# Altium schematic sheet BSPDSpring24.SchDoc
size Tabloid; DrawnBy: Ethan Zifzal; Revision: AE; SheetNumber: 1; SheetTotal: 1; Application_BuildNumber: ddd
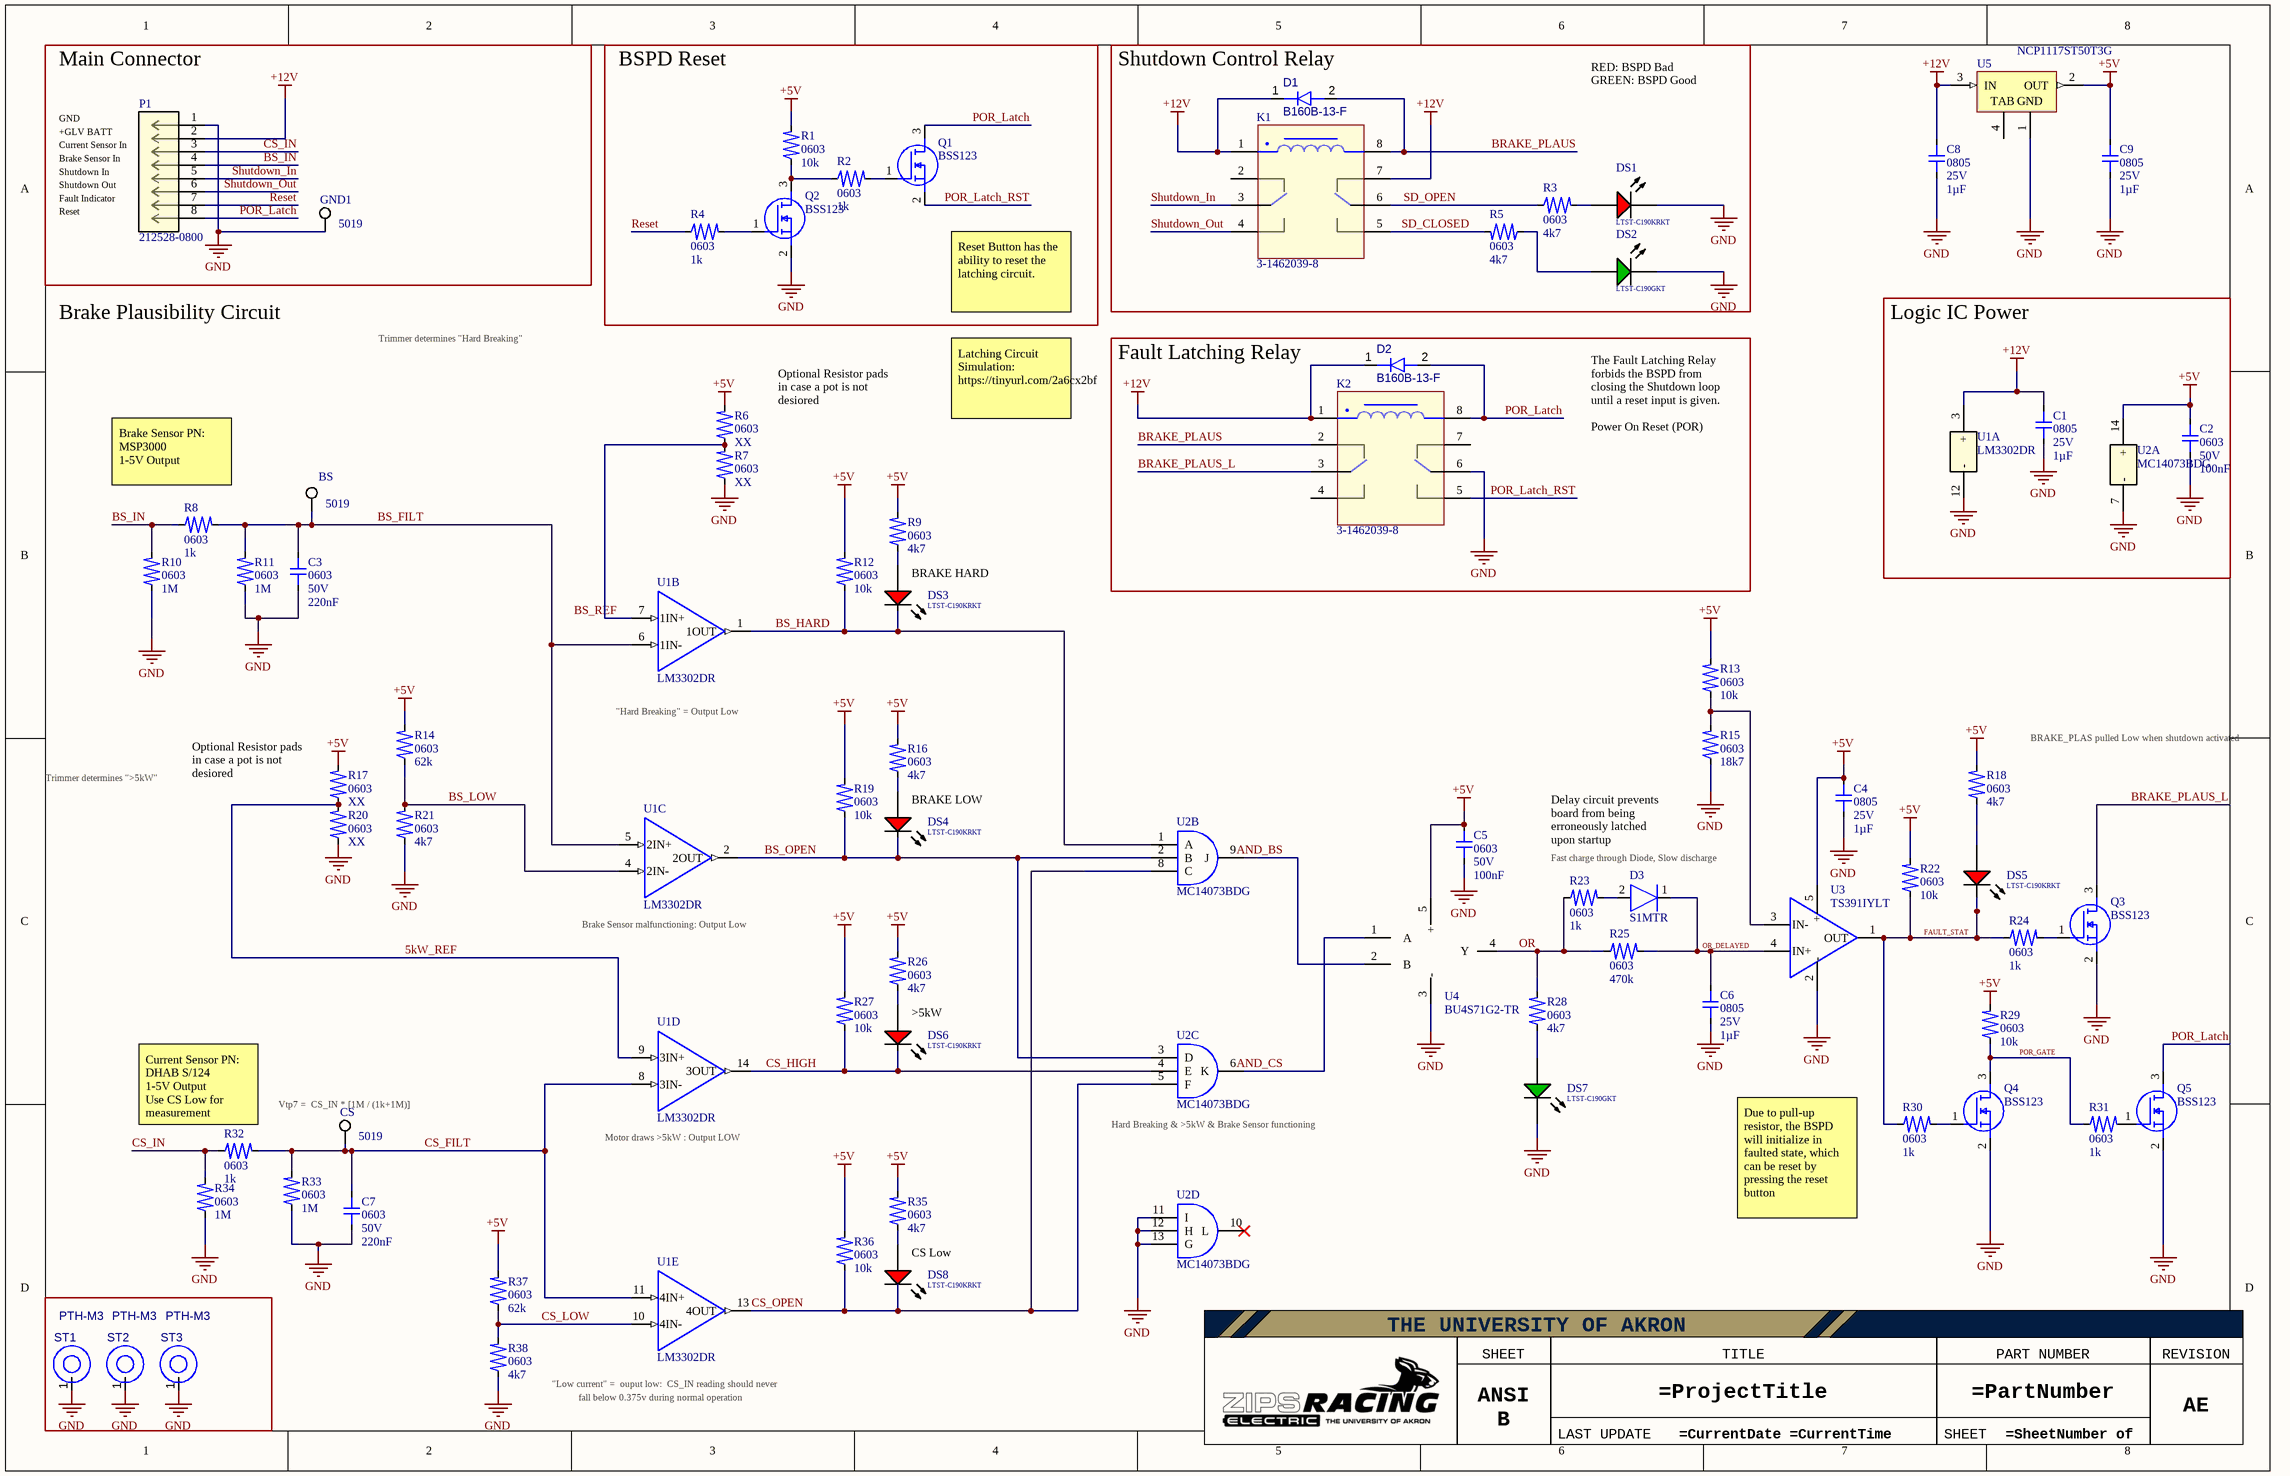
[diagram p0: BSPDSpring24.SchDoc]

## Parts
BS  5019  [KSTN-5019_V]
C1  value 1µF  Footprint: 0805  Voltage: 25V  [CAP-0805]  (hidden comment: Capacitor 1uF 0805 25V)
C2  value 100nF  Footprint: 0603  Voltage: 50V  [CAP-0603-Generic]  (hidden comment: Capacitor 100nF 0603 5%)
C3  value 220nF  Footprint: 0603  Voltage: 50V  [CAP-0603-Generic]  (hidden comment: Capacitor 220nF 0603 5%)
C4  value 1µF  Footprint: 0805  Voltage: 25V  [CAP-0805]  (hidden comment: Capacitor 1uF 0805 25V)
C5  value 100nF  Footprint: 0603  Voltage: 50V  [CAP-0603-Generic]  (hidden comment: Capacitor 100nF 0603 5%)
C6  value 1µF  Footprint: 0805  Voltage: 25V  [CAP-0805]  (hidden comment: Capacitor 1uF 0805 25V)
C7  value 220nF  Footprint: 0603  Voltage: 50V  [CAP-0603-Generic]  (hidden comment: Capacitor 220nF 0603 5%)
C8  value 1µF  Footprint: 0805  Voltage: 25V  [CAP-0805]  (hidden comment: Capacitor 1uF 0805 25V)
C9  value 1µF  Footprint: 0805  Voltage: 25V  [CAP-0805]  (hidden comment: Capacitor 1uF 0805 25V)
CS  5019  [KSTN-5019_V]
D1  B160B-13-F  [FP-SMB-MFG]
D2  B160B-13-F  [FP-SMB-MFG]
D3  S1MTR  [SMA_SDS]
DS1  LTST-C190KRKT  [LTST-C191KRKT_V]
DS2  LTST-C190GKT  [LTST-C190GKT_V]
DS3  LTST-C190KRKT  [LTST-C191KRKT_V]
DS4  LTST-C190KRKT  [LTST-C191KRKT_V]
DS5  LTST-C190KRKT  [LTST-C191KRKT_V]
DS6  LTST-C190KRKT  [LTST-C191KRKT_V]
DS7  LTST-C190GKT  [LTST-C190GKT_V]
DS8  LTST-C190KRKT  [LTST-C191KRKT_V]
GND1  5019  [KSTN-5019_V]
K1  3-1462039-8  [FP-3-1462039-8-MFG]
K2  3-1462039-8  [FP-3-1462039-8-MFG]
P1  212528-0800  [212528-0800-Footprint-1]
Q1  BSS123  [SOT96P237X111-3N]
Q2  BSS123  [SOT96P237X111-3N]
Q3  BSS123  [SOT96P237X111-3N]
Q4  BSS123  [SOT96P237X111-3N]
Q5  BSS123  [SOT96P237X111-3N]
R1  value 10k  Footprint: 0603  [RES-0603-Generic]  (hidden comment: Resistor 10k 0603 1%)
R2  value 1k  Footprint: 0603  [RES-0603-Generic]  (hidden comment: Resistor 1k 0603 1%)
R3  value 4k7  Footprint: 0603  [RES-0603-Generic]  (hidden comment: Resistor 4k7 0603 1%)
R4  value 1k  Footprint: 0603  [RES-0603-Generic]  (hidden comment: Resistor 1k 0603 1%)
R5  value 4k7  Footprint: 0603  [RES-0603-Generic]  (hidden comment: Resistor 4k7 0603 1%)
R6  value XX  Footprint: 0603  [RES-0603-Generic]  (hidden comment: Resistor XX 0603 1%)
R7  value XX  Footprint: 0603  [RES-0603-Generic]  (hidden comment: Resistor XX 0603 1%)
R8  value 1k  Footprint: 0603  [RES-0603-Generic]  (hidden comment: Resistor 1k 0603 1%)
R9  value 4k7  Footprint: 0603  [RES-0603-Generic]  (hidden comment: Resistor 4k7 0603 1%)
R10  value 1M  Footprint: 0603  [RES-0603-Generic]  (hidden comment: Resistor 1M 0603 1%)
R11  value 1M  Footprint: 0603  [RES-0603-Generic]  (hidden comment: Resistor 1M 0603 1%)
R12  value 10k  Footprint: 0603  [RES-0603-Generic]  (hidden comment: Resistor 10k 0603 1%)
R13  value 10k  Footprint: 0603  [RES-0603-Generic]  (hidden comment: Resistor 10k 0603 1%)
R14  value 62k  Footprint: 0603  [RES-0603-Generic]  (hidden comment: Resistor 62k 0603 1%)
R15  value 18k7  Footprint: 0603  [RES-0603-Generic]  (hidden comment: Resistor 10k 0603 1%)
R16  value 4k7  Footprint: 0603  [RES-0603-Generic]  (hidden comment: Resistor 4k7 0603 1%)
R17  value XX  Footprint: 0603  [RES-0603-Generic]  (hidden comment: Resistor XX 0603 1%)
R18  value 4k7  Footprint: 0603  [RES-0603-Generic]  (hidden comment: Resistor 4k7 0603 1%)
R19  value 10k  Footprint: 0603  [RES-0603-Generic]  (hidden comment: Resistor 10k 0603 1%)
R20  value XX  Footprint: 0603  [RES-0603-Generic]  (hidden comment: Resistor XX 0603 1%)
R21  value 4k7  Footprint: 0603  [RES-0603-Generic]  (hidden comment: Resistor 4k7 0603 1%)
R22  value 10k  Footprint: 0603  [RES-0603-Generic]  (hidden comment: Resistor 10k 0603 1%)
R23  value 1k  Footprint: 0603  [RES-0603-Generic]  (hidden comment: Resistor 1k 0603 1%)
R24  value 1k  Footprint: 0603  [RES-0603-Generic]  (hidden comment: Resistor 1k 0603 1%)
R25  value 470k  Footprint: 0603  [RES-0603-Generic]  (hidden comment: Resistor 470k 0603 1%)
R26  value 4k7  Footprint: 0603  [RES-0603-Generic]  (hidden comment: Resistor 4k7 0603 1%)
R27  value 10k  Footprint: 0603  [RES-0603-Generic]  (hidden comment: Resistor 10k 0603 1%)
R28  value 4k7  Footprint: 0603  [RES-0603-Generic]  (hidden comment: Resistor 4k7 0603 1%)
R29  value 10k  Footprint: 0603  [RES-0603-Generic]  (hidden comment: Resistor 10k 0603 1%)
R30  value 1k  Footprint: 0603  [RES-0603-Generic]  (hidden comment: Resistor 1k 0603 1%)
R31  value 1k  Footprint: 0603  [RES-0603-Generic]  (hidden comment: Resistor 1k 0603 1%)
R32  value 1k  Footprint: 0603  [RES-0603-Generic]  (hidden comment: Resistor 1k 0603 1%)
R33  value 1M  Footprint: 0603  [RES-0603-Generic]  (hidden comment: Resistor 1M 0603 1%)
R34  value 1M  Footprint: 0603  [RES-0603-Generic]  (hidden comment: Resistor 1M 0603 1%)
R35  value 4k7  Footprint: 0603  [RES-0603-Generic]  (hidden comment: Resistor 4k7 0603 1%)
R36  value 10k  Footprint: 0603  [RES-0603-Generic]  (hidden comment: Resistor 10k 0603 1%)
R37  value 62k  Footprint: 0603  [RES-0603-Generic]  (hidden comment: Resistor 62k 0603 1%)
R38  value 4k7  Footprint: 0603  [RES-0603-Generic]  (hidden comment: Resistor 4k7 0603 1%)
ST1  PTH-M3  [PTH-M2D5X5]  (no BOM)
ST2  PTH-M3  [PTH-M2D5X5]  (no BOM)
ST3  PTH-M3  [PTH-M2D5X5]  (no BOM)
U1  LM3302DR  [SOIC127P600X175-14N]  (parts A,B,C,D,E of 5)
U2  MC14073BDG  [MC14073BDG-Footprint-1]  (parts A,B,C,D of 4)
U3  TS391IYLT  [SOT23-5_STM]
U4  BU4S71G2-TR  [SSOP5_ROM-L]
U5  NCP1117ST50T3G  [ONSC-SOT-223-4-318H-01_A_V]

## Blocks framed on the sheet
Main Connector: GND1 P1
BSPD Reset: Q1 Q2 R1 R2 R4
Shutdown Control Relay: D1 DS1 DS2 K1 R3 R5
Logic IC Power: C1 C2 U1 U2
Fault Latching Relay: D2 K2

## Nets
+5V: C2.2 C4.2 C5.2 C9.2 R1.2 R6.2 R9.2 R12.2 R13.2 R14.2 R16.2 R17.2 R18.2 R19.2 R22.2 R26.2 R27.2 R29.2 R35.2 R36.2 R37.2 U2.14(+) U3.5(+) U4.5(+) U5.2(OUT)
+12V: C1.2 C8.2 D1.1(K) D2.1(K) K1.1 K1.7 K2.1 P1.2 U1.3(+) U5.3(IN)
GND: C1.1 C2.1 C3.1 C4.1 C5.1 C6.1 C7.1 C8.1 C9.1 DS1.2(K) DS2.2(K) DS7.2(K) GND1.1 K2.6 P1.1 Q2.2(S) Q3.2(S) Q4.2(S) Q5.2(S) R7.1 R10.1 R11.1 R15.1 R20.1 R21.1 R33.1 R34.1 R38.1 ST1.1(H1) ST2.1(H1) ST3.1(H1) U1.12(-) U2.7(-) U2.11(I) U2.12(H) U2.13(G) U3.2(-) U4.3(-) U5.1(GND)
5kW_REF: R17.1 R20.2 U1.9(3IN+)
AND_BS: U2.9(J) U4.2(B)
AND_CS: U2.6(K) U4.1(A)
BRAKE_PLAUS: D1.2(A) K1.8 K2.2
BRAKE_PLAUS_L: K2.3 Q3.3(D)
BS_FILT: BS.1 C3.2 R8.2 R11.2 U1.5(2IN+) U1.6(1IN-)
BS_HARD: DS3.2(K) R12.1 U1.1(1OUT) U2.1(A)
BS_IN: P1.4 R8.1 R10.2
BS_LOW: R14.1 R21.2 U1.4(2IN-)
BS_OPEN: DS4.2(K) R19.1 U1.2(2OUT) U2.2(B) U2.3(D)
BS_REF: R6.1 R7.2 U1.7(1IN+)
CS_FILT: C7.2 CS.1 R32.2 R33.2 U1.8(3IN-) U1.11(4IN+)
CS_HIGH: DS6.2(K) R27.1 U1.14(3OUT) U2.4(E)
CS_IN: P1.3 R32.1 R34.2
CS_LOW: R37.1 R38.2 U1.10(4IN-)
CS_OPEN: DS8.2(K) R36.1 U1.13(4OUT) U2.5(F) U2.8(C)
FAULT_STAT: DS5.2(K) R22.1 R24.1 R30.1 U3.1(OUT)
OR: R23.1 R25.1 R28.2 U4.4(Y)
OR_DELAYED: C6.2 D3.1(K) R25.2 U3.4(IN+)
POR_GATE: Q4.3(D) R29.1 R31.1
POR_Latch: D2.2(A) K2.8 P1.8 Q1.3(D) Q5.3(D)
POR_Latch_RST: K2.5 Q1.2(S)
Reset: P1.7 R4.1
SD_CLOSED: K1.5 R5.2
SD_OPEN: K1.6 R3.1
Shutdown_In: K1.3 P1.5
Shutdown_Out: K1.4 P1.6
NetD3_2: D3.2(A) R23.2
NetDS1_1: DS1.1(A) R3.2
NetDS2_1: DS2.1(A) R5.1
NetDS3_1: DS3.1(A) R9.1
NetDS4_1: DS4.1(A) R16.1
NetDS5_1: DS5.1(A) R18.1
NetDS6_1: DS6.1(A) R26.1
NetDS7_1: DS7.1(A) R28.1
NetDS8_1: DS8.1(A) R35.1
NetQ1_1: Q1.1(G) R2.2
NetQ2_1: Q2.1(G) R4.2
NetQ2_3: Q2.3(D) R1.1 R2.1
NetQ3_1: Q3.1(G) R24.2
NetQ4_1: Q4.1(G) R30.2
NetQ5_1: Q5.1(G) R31.2
NetR13_1: R13.1 R15.2 U3.3(IN-)

Not connected (* = marked no-connect by the designer): K1 2; K2 4 7; U2 10(L)*; U5 4(TAB)

## Notes on the sheet
- RED: BSPD Bad
  GREEN: BSPD Good
- +GLV BATT
- GND
- (near P1) Current Sensor In
- (near P1) Brake Sensor In
- Shutdown In
- Shutdown Out
- (near P1) Fault Indicator
- Reset
- Brake Plausibility Circuit
- Trimmer determines "Hard Breaking"
- (near Q1) Reset Button has the ability to reset the latching circuit.
- Optional Resistor pads in case a pot is not desiored
- Latching Circuit Simulation:
  https://tinyurl.com/2a6cx2bf
- The Fault Latching Relay forbids the BSPD from closing the Shutdown loop until a reset input is given.
- (near R8) Brake Sensor PN:
  MSP3000
  1-5V Output
- Power On Reset (POR)
- BRAKE HARD
- "Hard Breaking" = Output Low
- BRAKE_PLAS pulled Low when shutdown activated
- Trimmer determines ">5kW"
- BRAKE LOW
- Fast charge through Diode, Slow discharge
- Delay circuit prevents board from being erroneously latched upon startup
- (near U1) Brake Sensor malfunctioning: Output Low
- >5kW
- (near CS) Vtp7 =  CS_IN * [1M / (1k+1M)]
- (near R32) Current Sensor PN:
  DHAB S/124
  1-5V Output
  Use CS Low for measurement
- (near U1) Motor draws >5kW : Output LOW
- (near U2) Hard Breaking & >5kW & Brake Sensor functioning
- (near R30) Due to pull-up resistor, the BSPD will initialize in faulted state, which can be reset by pressing the reset button
- CS Low
- "Low current" =  ouput low:  CS_IN reading should never
- fall below 0.375v during normal operation
- THE UNIVERSITY OF AKRON
- SHEET SIZE
- TITLE
- PART NUMBER
- REVISION
- ANSI B
- LAST UPDATE
- SHEET
- (in symbol CMP-008-00010-2) .

## Library data of the parts
BS CS GND1 = CMP-00012-1: Interconnection Device
C1 C4 C6 C8 C9 = CMP-00045-1: Capacitor, 0805
C2 C5 = CMP-00030-2: Capacitor, 0603, 5%; Max Operating Temperature: 125°C; Min Operating Temperature: -55°C
C3 C7 = CMP-00071-2: Capacitor, 0603, 5%; Min Operating Temperature: -55°C; Max Operating Temperature: 125°C
D1 D2 = CMP-004-00032-1: Rectifier Diode, Schottky, 1 Phase, 1 Element, 1A, 60V V(RRM), Silicon; Forward Voltage: 700mV; Qualification Status: Not Qualified; RoHS Compliant: Yes; Surface Mount: Yes; Max Operating Temperature: 150°C; Max Output current: 1A; Min Operating Temperature: -65°C; Technology: SCHOTTKY; Pins: 2
D3 = CMP-004-00037-1: Diode Standard 1000 V 1A Surface Mount SMA (DO-214AC); Mfr_Name: SMC Diode Solutions; Type: DEV; Digi-Key_Part_Number_3: 1655-1506-6-ND; Digi-Key_Part_Number_2: 1655-1506-2-ND; Copyright: Copyright (C) 2021 Ultra Librarian. All rights reserved.; Design Item ID: S1MTR; RefDes: RefDes; Digi-Key_Part_Number_1: 1655-1506-1-ND; Digi-Key_Part_Number_4: S1MDITR-ND; Source: Zips_Racing_Electric.SchLib; Manufacturer_Part_Number: S1MTR
DS1 DS3-DS6 DS8 = CMP-007-00024-2: LED Uni-Color Red, 62.5 mW, 25 mA, -30 to 85 degC, 2-Pin SMD, RoHS, Tape and Reel; Manufacturer: Lite-On; Power: 75mW; Forward Voltage: 2V; Luminous Intensity: 54mcd; Lens Style: Diffused; Viewing Angle: 130degrees; Forward Current: 20mA; Manufacturer URL: http://www.us.liteon.com/; Case/Package: 0603; Datasheet Version: Rev. F, 05/2013; Package Reference: C191KRKT; Datasheet URL: http://optoelectronics.liteon.com/upload/download/DS-22-99-0151/S_110_LTST-C190KRKT.pdf; Package Description: 2-Pin Surface Mount Device, Body 1.6 x 0.8 mm; Nominal Vf: 2V; Packaging: TapeandReel; RoHS Compliant: True; Pins: 2; Illumination Colour: Red; Colour: Red; Mounting Technology: SM; Package Quantity: 3000; Min Operating Temperature: -55°C; Max Operating Temperature: 85°C
DS2 DS7 = CMP-007-00022-2: LED Uni-Color Green, 100 mW, 30 mA, -55 to 85 degC, 2-Pin SMD, RoHS, Tape and Reel; Manufacturer: Lite-On; Power: 100mW; Forward Voltage: 2.1V; Viewing Angle: 130degrees; Forward Current: 20mA; Luminous Intensity: 6mcd; Lens Style: Clear; Manufacturer URL: http://www.us.liteon.com/; RoHS Compliant: True; Colour: Green; Package Description: 2-Pin Surface Mount Device, Body 1.6 x 0.8 mm; Datasheet URL: http://datasheet.octopart.com/LTST-C190GKT-Lite-On-datasheet-158530.pdf; Datasheet Version: Dec-06; Mounting Technology: SM; Case/Package: 0603; Package Reference: C190GKT; Packaging: TapeandReel; Min Operating Temperature: -55°C; Nominal Vf: 2.1V; Package Quantity: 3000; Illumination Colour: Green; Max Operating Temperature: 85°C; Pins: 2
K1 K2 = CMP-008-00010-2: Power/Signal Relay, 2 Form C, DPDT, Momentary, 0.01A (Coil), 12VDC (Coil), 140mW (Coil), 5A (Contact), 220VDC (Contact), DC Input, Random, AC/DC Output, Through Hole-Straight Mount; Operate Time: 3ms; Mounting Technology: Through-hole; Pins: 8; Max Operating Temperature: 85°C; Current Rating: 5A; Min Operating Temperature: -40°C; Contact Form: DPDT; RoHS Compliant: Yes; ComponentLink1URL: https://www.te.com/commerce/DocumentDelivery/DDEController?Action=srchrtrv&DocNm=108-98001&DocType=Data+Sheet&DocLang=English&DocFormat=pdf&PartCntxt=3-1462039-8; ComponentLink1Description: Datasheet
P1 = CMP-002-00130-1: Connector Power Header 8POS 3mm Solder Right Angle Through Hole Tray; Gender: Male; Pins: 8
Q1-Q5 = CMP-023-000002-1: MOSFET N-CH 100V 170MA SOT23-3; Manufacturer_Name: ON Semiconductor; Datasheet Link: http://uk.rs-online.com/web/p/products/6710321; Mouser Price/Stock: https://www.mouser.co.uk/ProductDetail/ON-Semiconductor-Fairchild/BSS123?qs=FOlmdCx%252BAA2Kf8SEB3qLYA%3D%3D; Arrow Part Number: BSS123; Arrow Price/Stock: https://www.arrow.com/en/products/bss123/on-semiconductor; Manufacturer_Part_Number: BSS123; Source: Zips_Racing_Electric.SchLib; Design Item ID: BSS123; Height: 1.11mm; Mouser Part Number: 512-BSS123
R1 R12 R13 R15 R19 R22 R27 R29 R36 = CMP-00020-12: Resistor, 0603, 10k; Power: 100mW; Minimum Operating Temperature: -55°C; Tolerance: 1%; Maximum Operating Temperature: 155°C; Max Operating Temperature: 155°C; Min Operating Temperature: -55°C; Datasheet: https://www.seielect.com/catalog/sei-rmcf_rmcp.pdf
R2 R4 R8 R23 R24 R30-R32 = CMP-00021-7: Resistor, 0603, 1k; Power: 100mW; Max Operating Temperature: 155°C; Min Operating Temperature: -55°C; Datasheet: https://www.seielect.com/catalog/sei-rmcf_rmcp.pdf; Tolerance: 1%
R3 R5 R9 R16 R18 R21 R26 R28 R35 R38 = CMP-00023-3: Resistor, 0603, 1%, 1/10W; Power: 100mW; Tolerance: 1%; Datasheet: https://www.seielect.com/catalog/sei-rmcf_rmcp.pdf; Max Operating Temperature: 155°C; Min Operating Temperature: -55°C
R6 R7 R17 R20 = CMP-00039-1: Resistor, 0603, XX; Power: 100mW; Min Operating Temperature: -55°C; Max Operating Temperature: 155°C; Tolerance: 1%; Datasheet: https://www.seielect.com/catalog/sei-rmcf_rmcp.pdf
R10 R11 R33 R34 = CMP-00041-2: Resistor, 0603, 1%, 1/10W; Power: 100mW; Tolerance: 1%; Datasheet: https://www.seielect.com/catalog/sei-rmcf_rmcp.pdf; Max Operating Temperature: 155°C; Min Operating Temperature: -55°C
R14 R37 = CMP-00072-1: Resistor, 0603, 62k; Power: 100mW; Min Operating Temperature: -55°C; Datasheet: https://www.seielect.com/catalog/sei-rmcf_rmcp.pdf; Max Operating Temperature: 155°C; Tolerance: 1%
R25 = CMP-00018-2: Resistor, 0603, 1%, 1/10W; Power: 100mW; Min Operating Temperature: -55°C; Tolerance: 1%; Datasheet: https://www.seielect.com/catalog/sei-rmcf_rmcp.pdf; Max Operating Temperature: 155°C
ST1-ST3 = CMP-00028-00008-6: M3 Plated Thru-Hole  (3.2mm), 7mm pad, 10 mm keep out zone; Pins: 1
U1 = CMP-033-000000-2: Quad, General Purpose Differential Comparator; MF: Texas Instruments; Design Item ID: LM3302DR; SnapEDA_Link: https://www.snapeda.com/parts/LM3302DR/Texas+Instruments/view-part/?ref=snap; Component Type: Standard; Pin Count: 14; Price: None; Value: *; Check_prices: https://www.snapeda.com/parts/LM3302DR/Texas+Instruments/view-part/?ref=eda; Purchase-URL: https://pricing.snapeda.com/search/part/LM3302DR/?ref=eda; Package: SOIC-14 Texas Instruments; MP: LM3302DR; Source: LM3302DR.SchLib; Availability: In Stock
U2 = CMP-016-00011-1: MC14073BDG; Triple 3-Input AND Logic Gate; 3 - 18 V; 14-Pin SOIC; Max Supply Voltage: 18V; Min Supply Voltage: 3V; Logic Function: AND GATE; Low Level Output Current: 4.2mA; Number of Circuits: 3; High Level Output Current: -4.2mA; Length: 8.75mm; Lead Free: Lead Free; Max Operating Temperature: 125°C; Height: 1.5mm; Mounting Technology: Surface Mount; Case/Package: SOIC; Min Operating Temperature: -55°C
U3 = CMP-031-00010-1: Comparator General Purpose CMOS, DTL, ECL, Open-Collector, TTL SOT-23-5; Mfr_Name: STMicroelectronics; Copyright: Copyright (C) 2021 Ultra Librarian. All rights reserved.; Source: Zips_Racing_Electric.SchLib; Design Item ID: TS391IYLT; Manufacturer_Part_Number: TS391IYLT; Digi-Key_Part_Number_2: 497-10245-2-ND; Type: DEV; Digi-Key_Part_Number_1: 497-10245-1-ND; RefDes: RefDes; Digi-Key_Part_Number_3: 497-10245-6-ND
U4 = CMP-031-00013-2: IC GATE OR 1CH 2-INP 5SSOP; SourceLibrary: ROHM_2019-10-21; Vendor: ROHM Semiconductor; Built_By: EMA_Molly; Min Supply Voltage: 3V; Max Supply Voltage: 16V; RefDes: RefDes; Copyright: Copyright (C) 2018 Accelerated Designs. All rights reserved; Type: DEV; Case/Package: LSSOP; Source: Zips_Racing_Electric.SchLib; Design Item ID: BU4S71G2-TR; Manufacturer_Part_Number: BU4S71G2-TR; Min Operating Temperature: -40°C; RoHS Compliant: Yes; Pins: 5; Max Operating Temperature: 85°C
U5 = CMP-019-00031-3: Low-Dropout Positive Fixed Voltage Regulator, 1 A, 5 V Vout, 0 to 125 degC, 4-Pin SOT-223, Pb-Free, Tape and Reel; Manufacturer: ON Semiconductor; Current Rating: -600A; Output Voltage: 5V; Max Ouput Current: 1A; Max Input Voltage: 20V; Outputs: 1; Dropout Voltage: 1.2V; Min Input Voltage: 3.5V; Datasheet Version: Rev. 26, 08/2013; Package Quantity: 4000; Package Description: 4-Pin Small Outline Transistor, Body 6.5 x 3.5 mm, Pitch 2.3 mm; RoHS Compliant: True; Max Operating Temperature: 125°C; Nominal Output Voltage: 5V; Datasheet URL: https://datasheet.ciiva.com/28483/1748260-28483320.pdf; Min Operating Temperature: 0°C; Manufacturer URL: http://www.onsemi.com/; Output Current: 1A; Pins: 3; Mounting Technology: SM; Package Reference: SOT-223-4-318H-01_A; Case/Package: TO-261-4; Packaging: TapeandReel